# EAGLE design 612_jetracer_esp32s3_030002 (EAGLE 9.6.2)
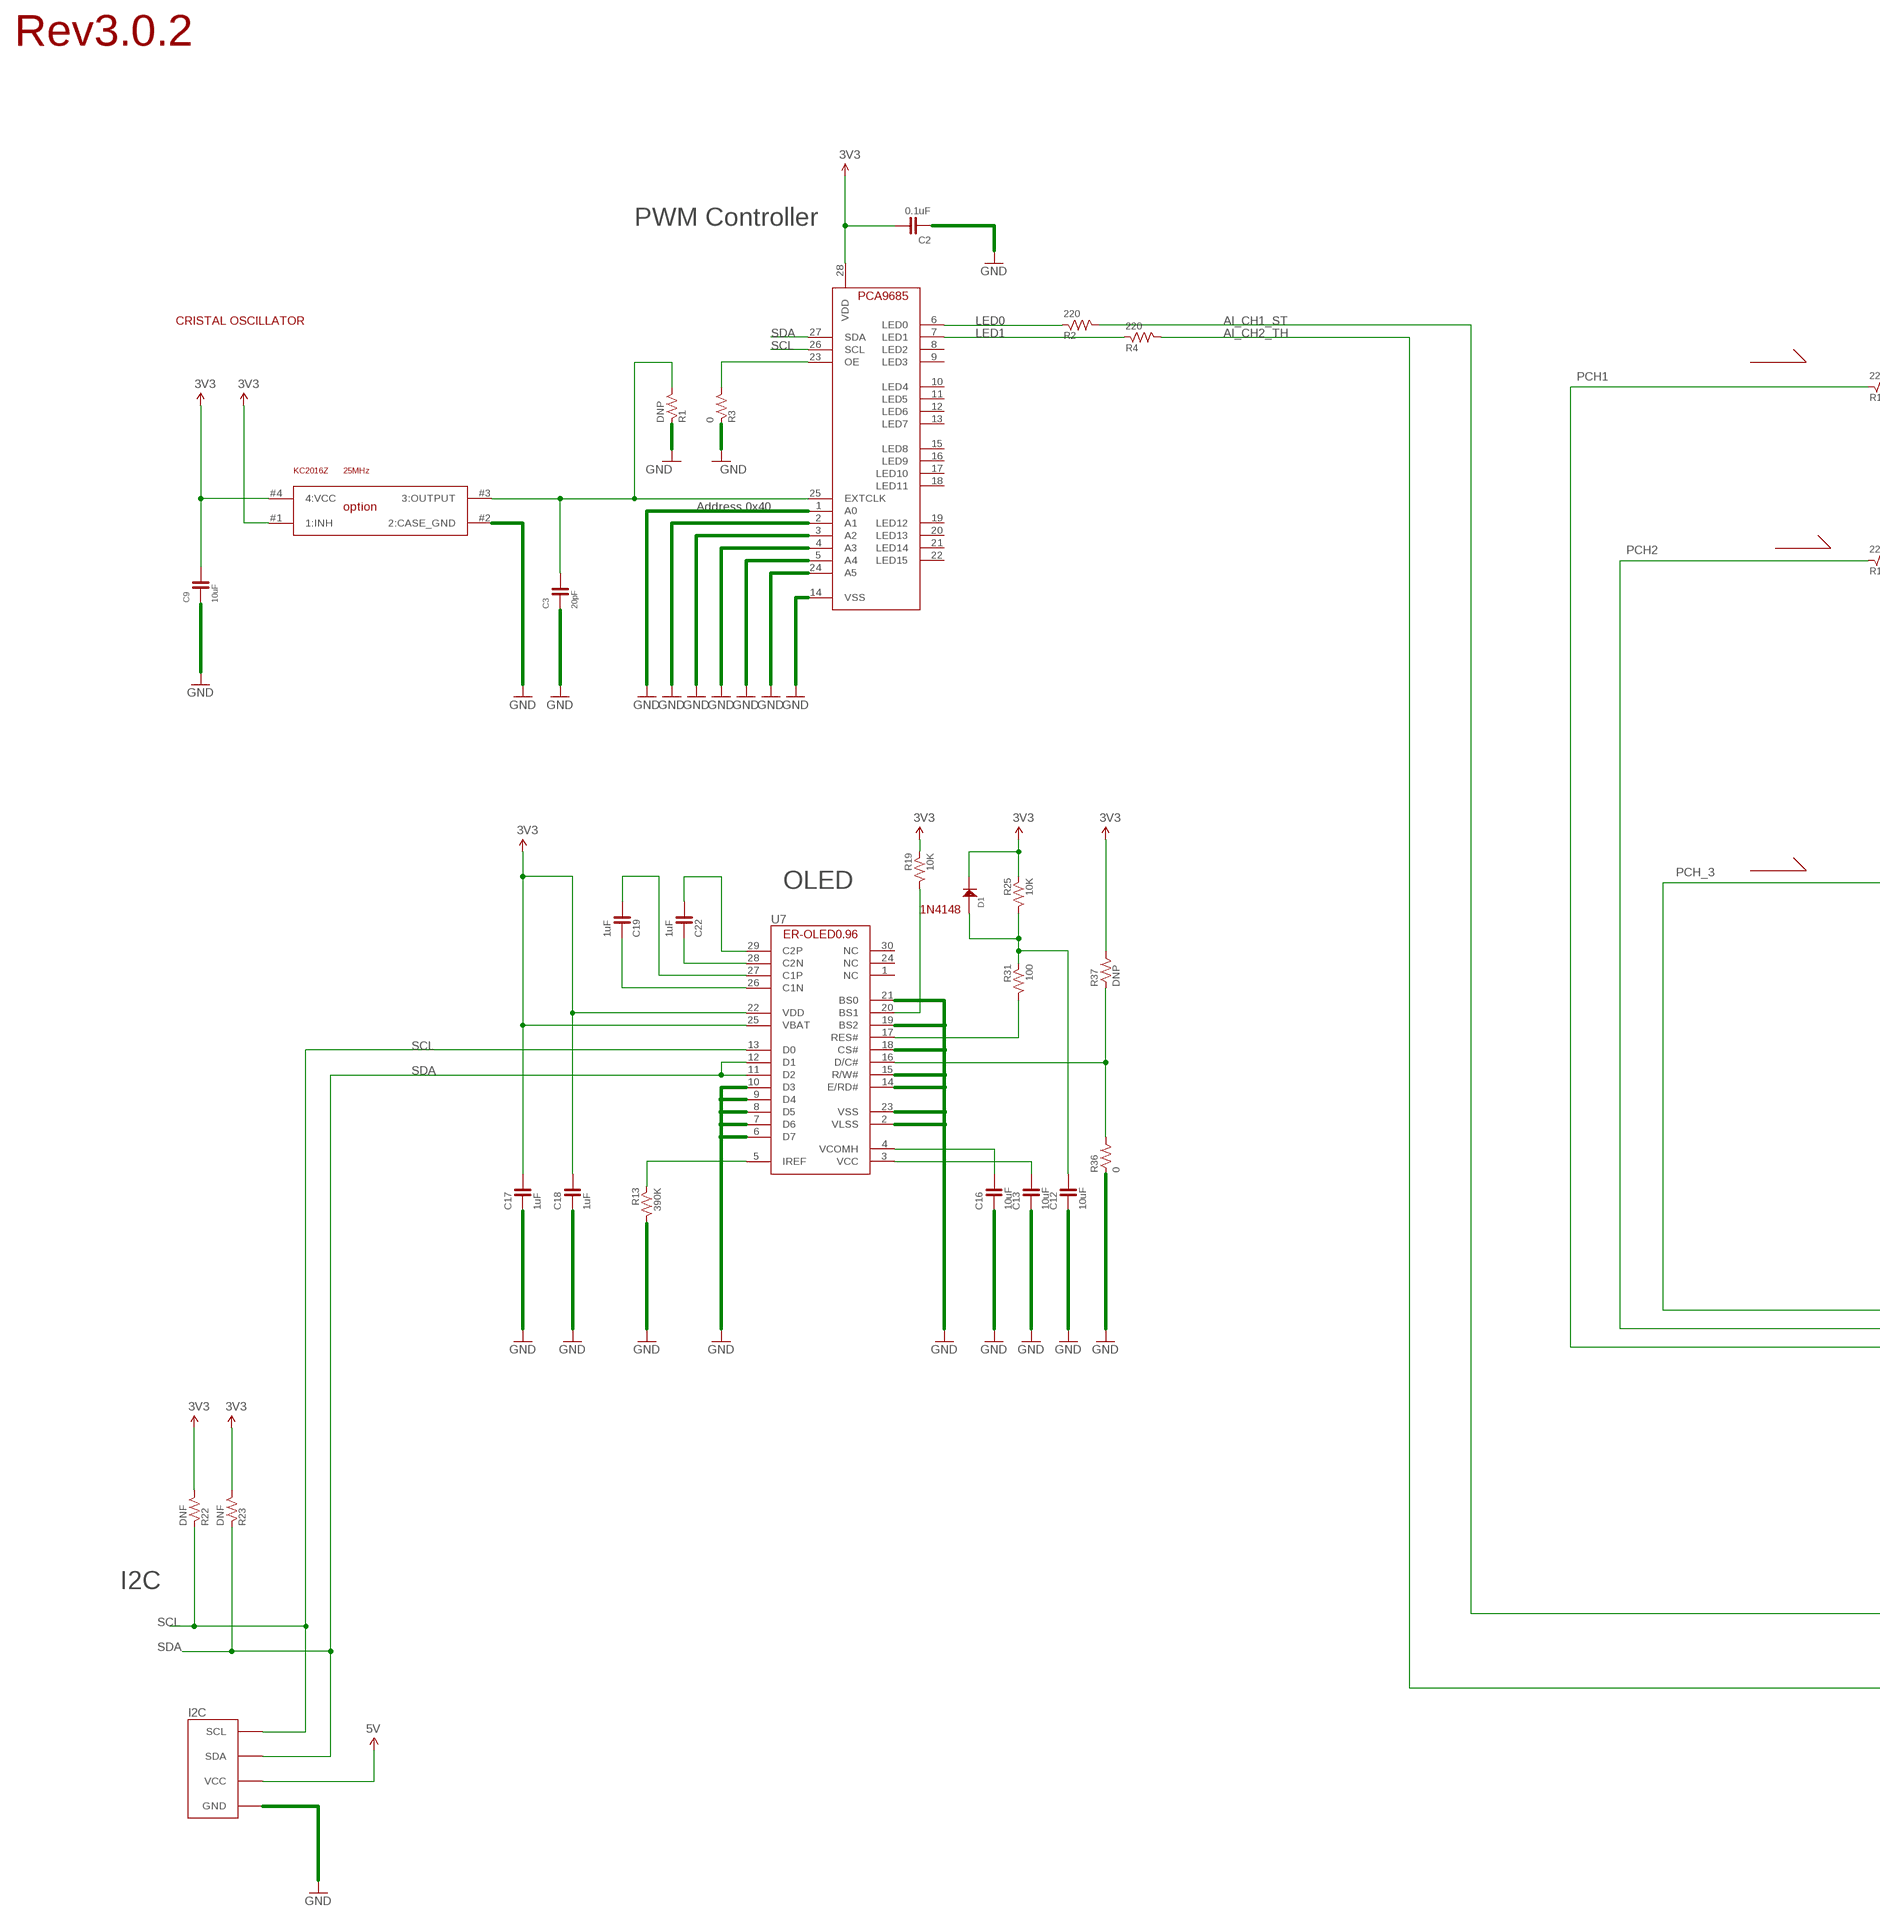
[diagram p0: schematic, sheet 1, part 1 of 3]
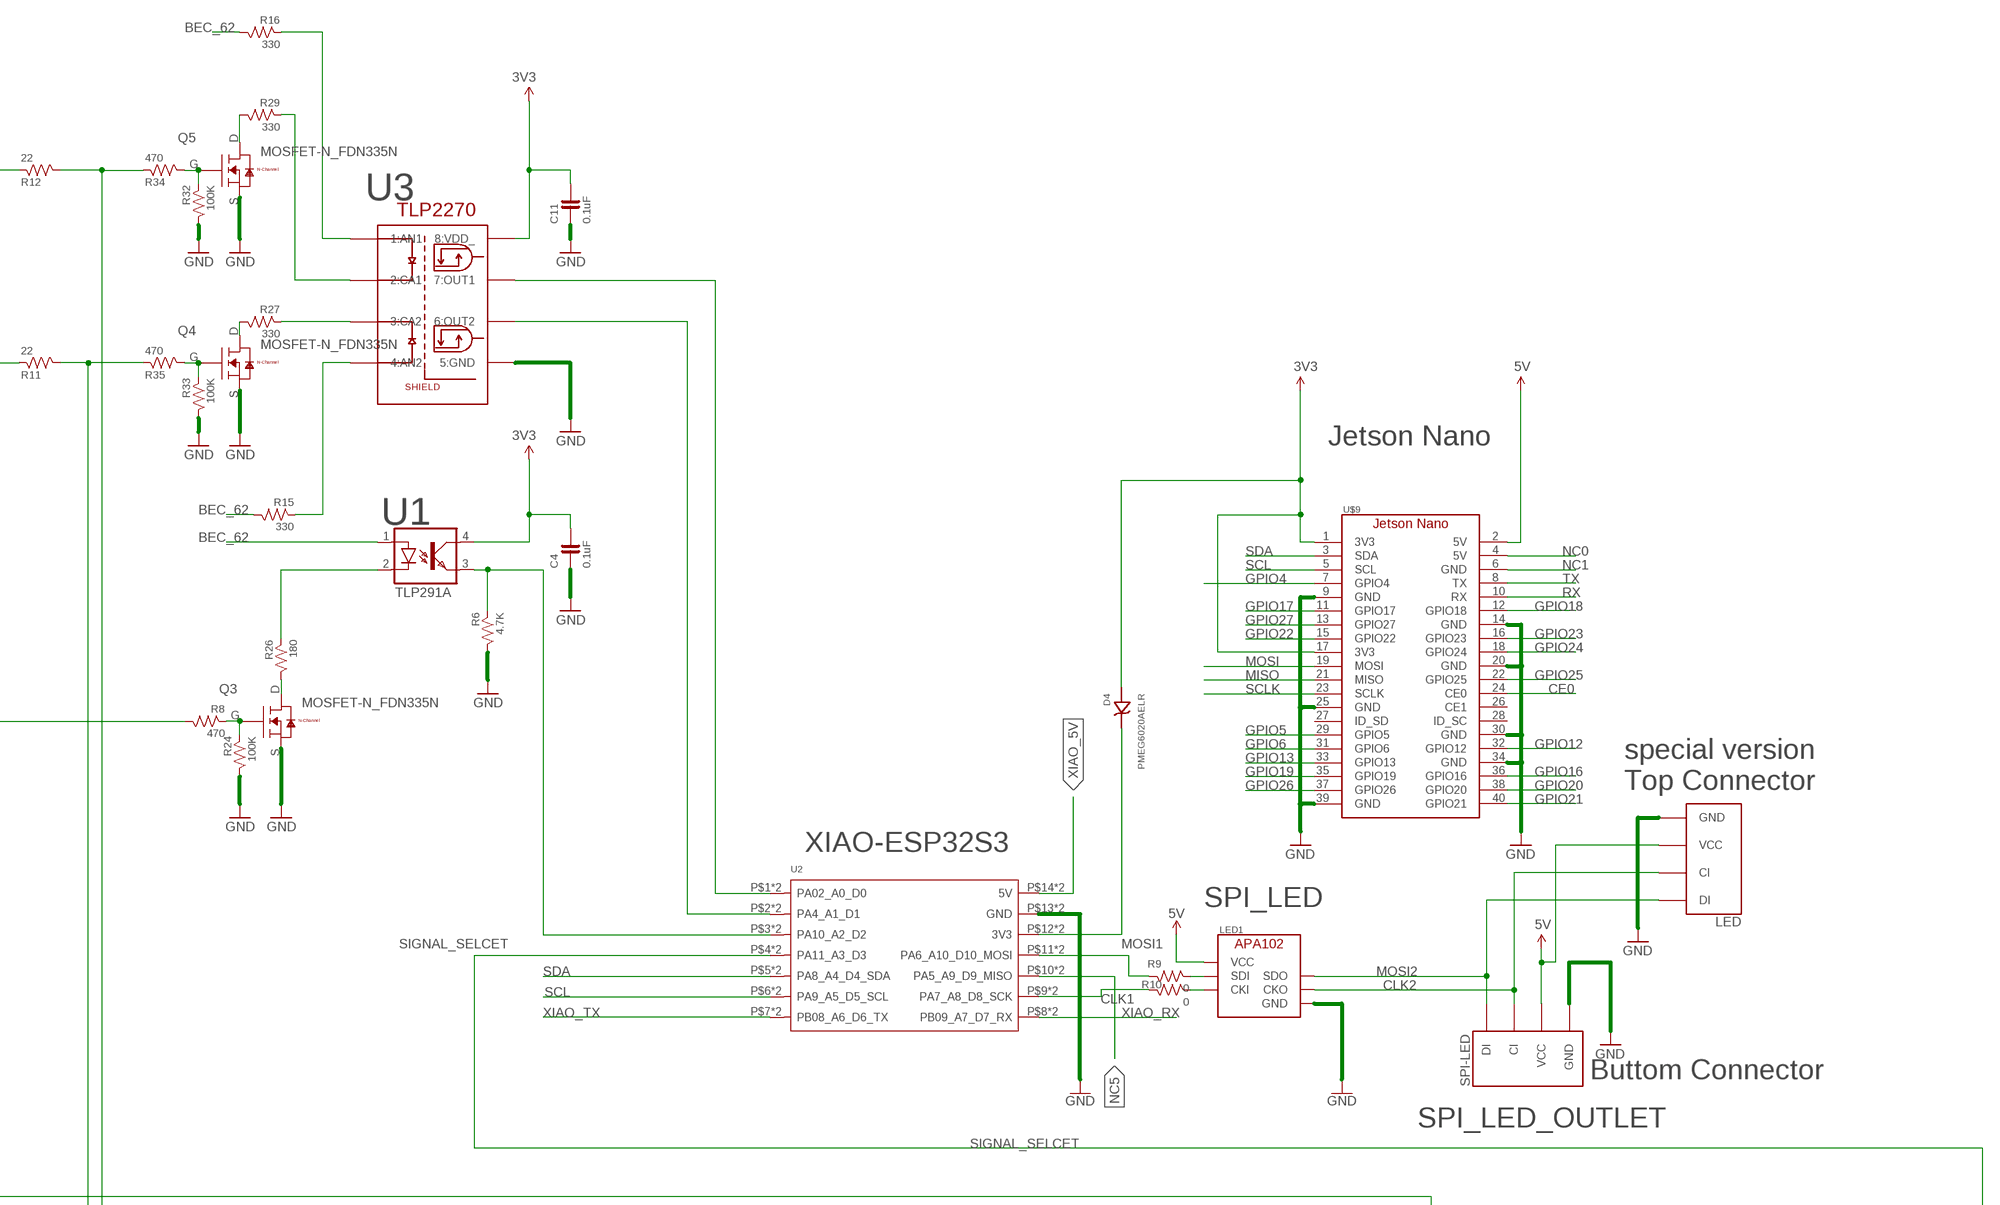
[diagram p1: schematic, sheet 1, part 2 of 3]
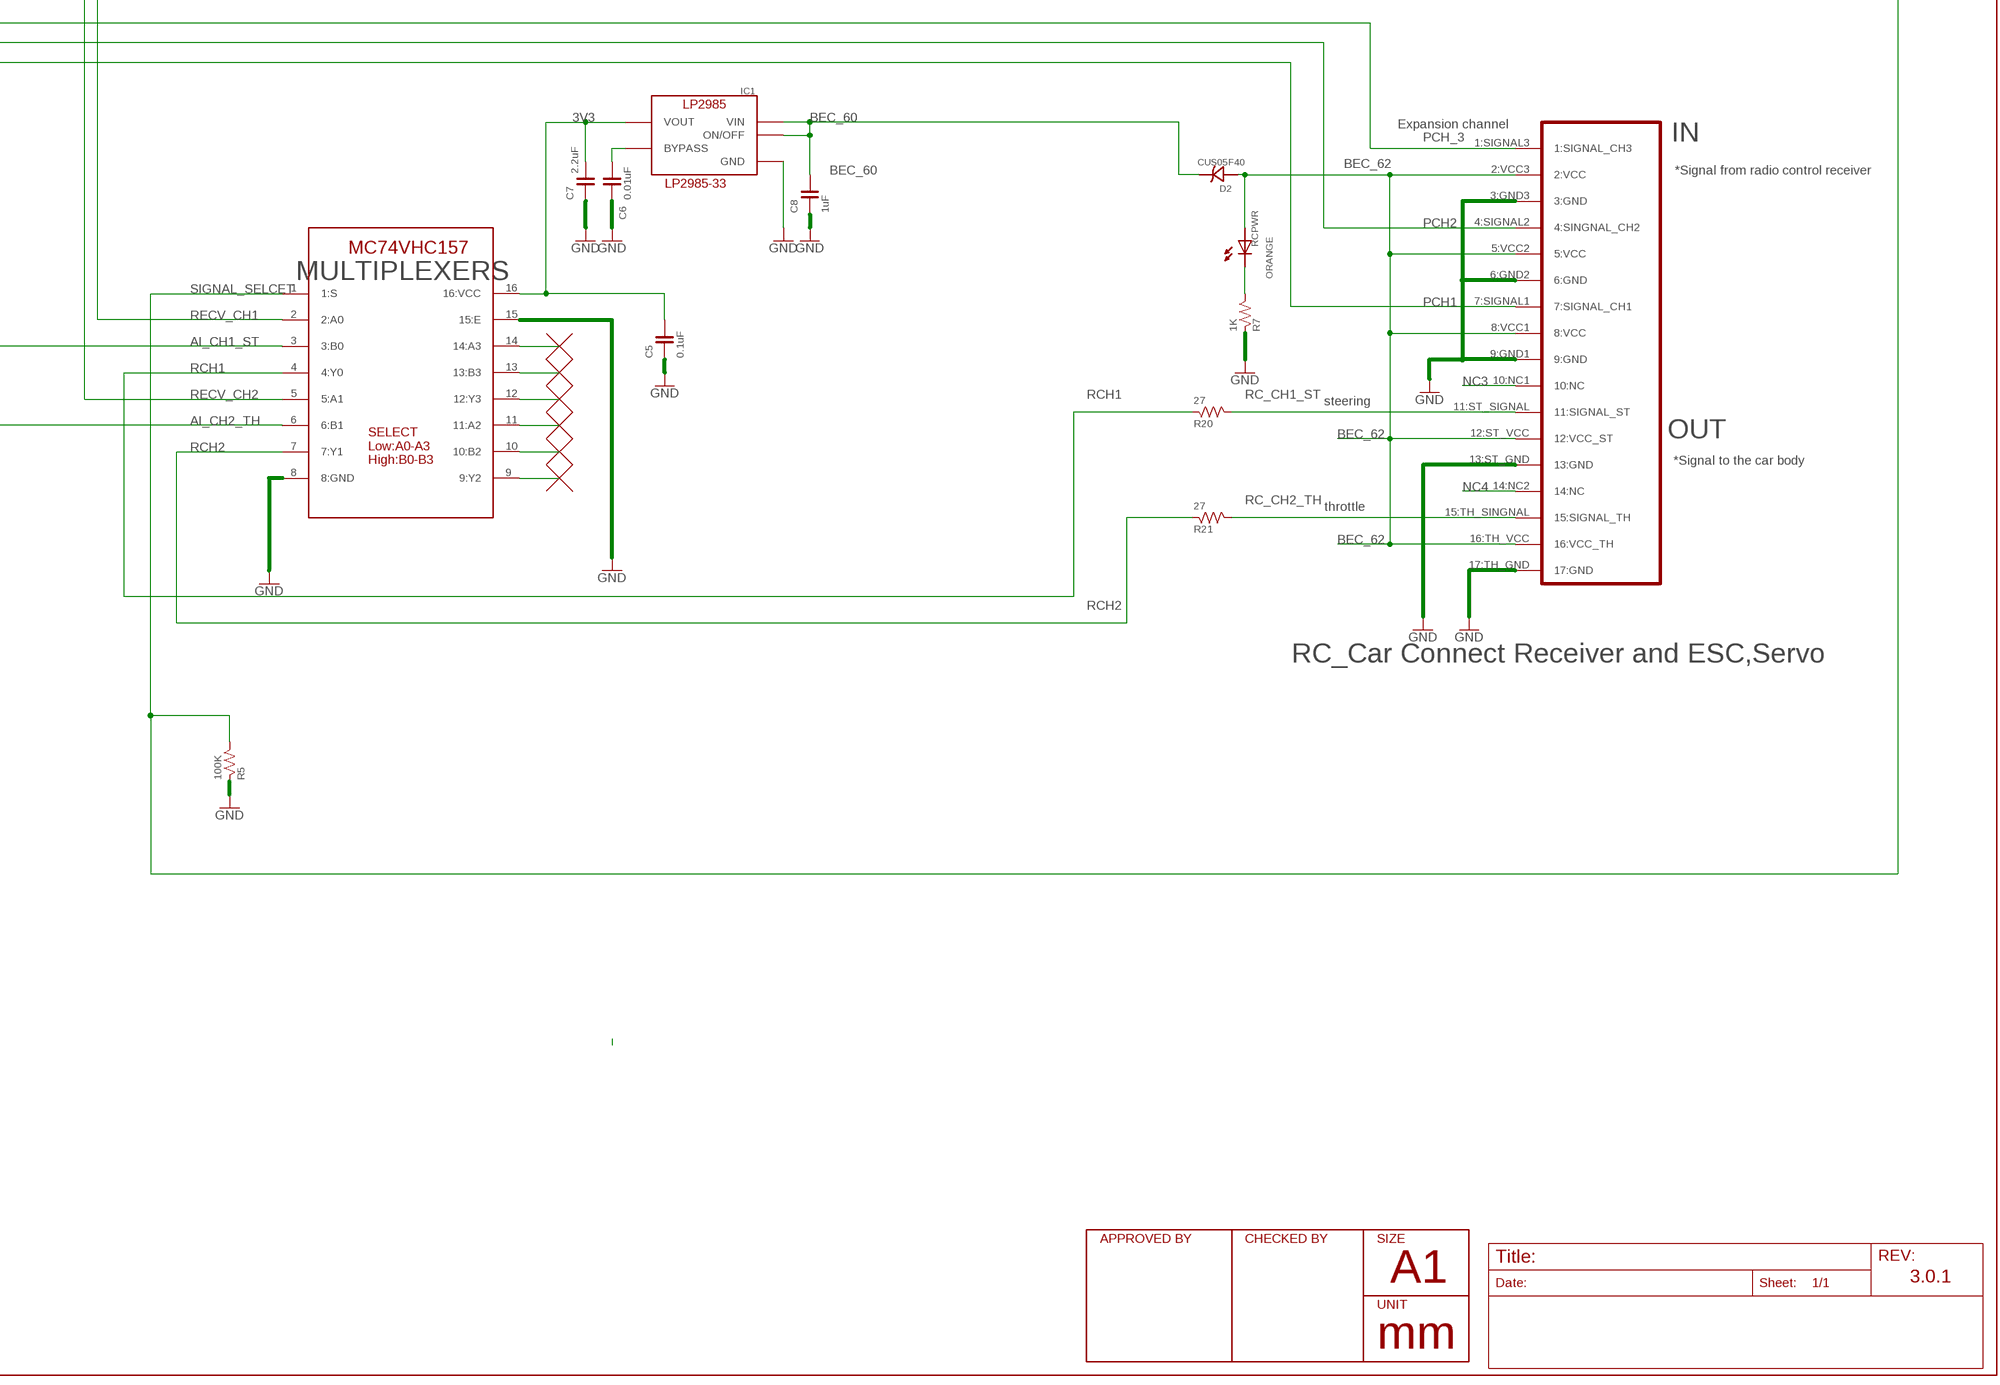
[diagram p2: schematic, sheet 1, part 3 of 3]

## Parts
C2  0.1uF  CAPACITOR-0603  [0603]
C3  20pF  CAPACITOR-0402  [0402]
C4  0.1uF  CAPACITOR-0603  [0603]
C5  0.1uF  CAPACITOR-0603  [0603]
C6  0.01uF  CAPACITOR-0603  [0603]
C7  2.2uF  CAPACITOR-0603  [0603]
C8  1uF  CAPACITOR-0603  [0603]
C9  10uF  CAPACITOR-0402  [0402]
C11  0.1uF  CAPACITOR-0603  [0603]
C12  10uF  CAPACITOR-0603  [0603]
C13  10uF  CAPACITOR-0603  [0603]
C16  10uF  CAPACITOR-0603  [0603]
C17  1uF  CAPACITOR-0603  [0603]
C18  1uF  CAPACITOR-0603  [0603]
C19  1uF  CAPACITOR-0603  [0603]
C22  1uF  CAPACITOR-0603  [0603]
D1  1N4148  [1N4148W]
D2  CUS05F40  [CUS05F40]
D4  PMEG6020AELR  [SOD123W]
I2C  FABO-I2C  [I2C-SM04B-PASS-1-FL]
IC1  LP2985-33DBV  [SOT-23-5]
IC4  PCA9685_BOTTOM  [PCA9685_BOTTOM]
LED  FABO-SPI-LED-B04B  [SPI-B04B-PASK-1]
LED1  APA102_IPIXEL  [APA102_2020]
Q3  MOSFET-N_FDN335N  [SUPERSOT-3]
Q4  MOSFET-N_FDN335N  [SUPERSOT-3]
Q5  MOSFET-N_FDN335N  [SUPERSOT-3]
R1  DNP  RESISTOR-0603  [0603]
R2  220  RESISTOR-0603  [0603]
R3  0  RESISTOR-0603  [0603]
R4  220  RESISTOR-0603  [0603]
R5  100K  RESISTOR-0603  [0603]
R6  4.7K  RESISTOR-0603  [0603]
R7  1K  RESISTOR-0603  [0603]
R8  470  RESISTOR-0603  [0603]
R9  0  RESISTOR-0603  [0603]
R10  0  RESISTOR-0603  [0603]
R11  22  RESISTOR-0603  [0603]
R12  22  RESISTOR-0603  [0603]
R13  390K  RESISTOR-0603  [0603]
R15  330  RESISTOR-0603  [0603]
R16  330  RESISTOR-0603  [0603]
R19  10K  RESISTOR-0603  [0603]
R20  27  RESISTOR-0603  [0603]
R21  27  RESISTOR-0603  [0603]
R22  DNF  RESISTOR-0603  [0603]
R23  DNF  RESISTOR-0603  [0603]
R24  100K  RESISTOR-0603  [0603]
R25  10K  RESISTOR-0603  [0603]
R26  180  RESISTOR-0603  [0603]
R27  330  RESISTOR-0603  [0603]
R29  330  RESISTOR-0603  [0603]
R31  100  RESISTOR-0603  [0603]
R32  100K  RESISTOR-0603  [0603]
R33  100K  RESISTOR-0603  [0603]
R34  470  RESISTOR-0603  [0603]
R35  470  RESISTOR-0603  [0603]
R36  0  RESISTOR-0805  [0805]
R37  DNP  RESISTOR-0805  [0805]
RCPWR  ORANGE  LED-0603  [0603]
SPI-LED  FABO-SPI-LED  [SPI-SM04B-PASS-1-FL]
U1  TLP291A  [11-3C1]
U2  MOUDLE-SEEEDUINO-XIAO-ESP32C3  [MOUDLE14P-DIP]
U3  TLP2270  [TLP2270]
U7  ER-OLED0.96-1ER-CON30HT-1  [ER-CON30HT-1]
U$1  RC_17PIN_OUTIN  [PNHEADER_2.54_SMT_17PIN_RC_TT01_02]
U$3  MC74VHC157  [MC74VHC157_TSSOP-16]
U$9  JETSON_NANOJETSON_NANO_OVERALL  [JETSON_NANO_DEMENTION]
U$11  KC2016Z  [KC2016Z]

## Nets
3V3: C5.2 C7.2 IC1.5(VOUT) U$3.16(16:VCC)
3V3_JETSON: C2.2 C4.2 C9.2 C11.2 C17.2 C18.2 D1.CATHODE D4.2(ANODE) IC4.28(VDD) R19.1 R22.2 R23.2 R25.1 R37.2 U1.4(COL) U3.8(8:VDD_) U7.22(VDD) U7.25(VBAT) U$9.1(3V3) U$9.17(3V3) U$11.#1(1:INH) U$11.#4(4:VCC) ; supply symbol labelled 3V3
5V_JETSON: I2C.5V(VCC) LED1.VCC LED.VCC SPI-LED.5V(VCC) U$9.2(5V) ; supply symbol labelled 5V
AI_CH1_ST: R2.2 U$3.3(3:B0)
AI_CH2_TH: R4.2 U$3.6(6:B1)
BEC_60: C8.2 D2.C(CATHODE) IC1.1(VIN) IC1.3(ON/OFF)
BEC_62: D2.A(ANODE) R15.2 R16.2 RCPWR.ANODE U1.1(A) U$1.2:VCC3(2:VCC) U$1.5:VCC2(5:VCC) U$1.8:VCC1(8:VCC) U$1.12:ST_VCC(12:VCC_ST) U$1.16:TH_VCC(16:VCC_TH)
CE0: U$9.24(CE0)
CK: LED1.CKI R10.1
CLK1: R10.2 U2.P$9(PA7_A8_D8_SCK) U2.P$23(PA7_A8_D8_SCK)
CLK2: LED1.CKO LED.CI SPI-LED.CI
GND: C2.1 C3.1 C4.1 C5.1 C6.1 C7.1 C8.1 C9.1 C11.1 C12.1 C13.1 C16.1 C17.1 C18.1 I2C.GND IC1.2(GND) IC4.1(A0) IC4.2(A1) IC4.3(A2) IC4.4(A3) IC4.5(A4) IC4.14(VSS) IC4.24(A5) LED1.GND LED.GND Q3.S Q4.S Q5.S R1.1 R3.1 R5.1 R6.2 R7.1 R13.2 R24.2 R32.2 R33.2 R36.1 SPI-LED.GND U2.P$13(GND) U2.P$27(GND) U3.5(5:GND) U7.2(VLSS) U7.6(D7) U7.7(D6) U7.8(D5) U7.9(D4) U7.10(D3) U7.14(E/RD#) U7.15(R/W#) U7.18(CS#) U7.19(BS2) U7.21(BS0) U7.23(VSS) U$1.3:GND3(3:GND) U$1.6:GND2(6:GND) U$1.9:GND1(9:GND) U$1.13:ST_GND(13:GND) U$1.17:TH_GND(17:GND) U$3.8(8:GND) U$3.15(15:E) U$9.9(GND) U$9.14(GND) U$9.20(GND) U$9.25(GND) U$9.30(GND) U$9.34(GND) U$9.39(GND) U$11.#2(2:CASE_GND)
GPIO4: U$9.7(GPIO4)
GPIO5: U$9.29(GPIO5)
GPIO6: U$9.31(GPIO6)
GPIO12: U$9.32(GPIO12)
GPIO13: U$9.33(GPIO13)
GPIO16: U$9.36(GPIO16)
GPIO17: U$9.11(GPIO17)
GPIO18: U$9.12(GPIO18)
GPIO19: U$9.35(GPIO19)
GPIO20: U$9.38(GPIO20)
GPIO21: U$9.40(GPIO21)
GPIO22: U$9.15(GPIO22)
GPIO23: U$9.16(GPIO23)
GPIO24: U$9.18(GPIO24)
GPIO25: U$9.22(GPIO25)
GPIO26: U$9.37(GPIO26)
GPIO27: U$9.13(GPIO27)
LED0: IC4.6(LED0) R2.1
LED1: IC4.7(LED1) R4.1
MISO: U$9.21(MISO)
MOSI: U$9.19(MOSI)
MOSI1: R9.2 U2.P$11(PA6_A10_D10_MOSI) U2.P$25(PA6_A10_D10_MOSI)
MOSI2: LED1.SDO LED.DI SPI-LED.DI
MS: LED1.SDI R9.1
N$2: U$3.9(9:Y2)
N$3: C22.2 U7.29(C2P)
N$4: U$3.10(10:B2)
N$5: U2.P$1(PA02_A0_D0) U2.P$15(PA02_A0_D0) U3.7(7:OUT1)
N$6: R26.1 U1.2(C)
N$7: IC4.23(OE) R3.2
N$8: U2.P$2(PA4_A1_D1) U2.P$16(PA4_A1_D1) U3.6(6:OUT2)
N$9: R15.1 U3.4(4:AN2)
N$12: R16.1 U3.1(1:AN1)
N$14: R13.1 U7.5(IREF)
N$16: C19.2 U7.27(C1P)
N$17: C13.2 U7.3(VCC)
N$18: R31.2 U7.17(RES#)
N$19: U$3.11(11:A2)
N$20: U$3.12(12:Y3)
N$21: C19.1 U7.26(C1N)
N$22: C22.1 U7.28(C2N)
N$23: Q3.G R8.1 R24.1
N$24: R7.2 RCPWR.CATHODE
N$25: C16.2 U7.4(VCOMH)
N$26: Q3.D R26.2
N$27: Q4.D R27.2
N$28: R27.1 U3.3(3:CA2)
N$29: Q5.D R29.2
N$30: R29.1 U3.2(2:CA1)
N$31: U$3.13(13:B3)
N$32: C12.2 D1.ANODE R25.2 R31.1
N$33: Q5.G R32.1 R34.2
N$34: D4.1(CATHODE) U2.P$12(3V3) U2.P$26(3V3)
N$35: U$3.14(14:A3)
N$37: R36.2 R37.1 U7.16(D/C#)
N$38: Q4.G R33.1 R35.2
N$40: C6.2 IC1.4(BYPASS)
N$41: C3.2 IC4.25(EXTCLK) R1.2 U$11.#3(3:OUTPUT)
N$50: R19.2 U7.20(BS1)
NC0: U$9.4(5V)
NC1: U$9.6(GND)
NC3: U$1.10:NC1(10:NC)
NC4: U$1.14:NC2(14:NC)
NC5: U2.P$10(PA5_A9_D9_MISO) U2.P$24(PA5_A9_D9_MISO)
PCH1: R12.1 U$1.7:SIGNAL1(7:SIGNAL_CH1)
PCH2: R11.1 U$1.4:SIGNAL2(4:SINGNAL_CH2)
PCH3_328: R6.1 U1.3(EMI) U2.P$3(PA10_A2_D2) U2.P$17(PA10_A2_D2)
PCH_3: R8.2 U$1.1:SIGNAL3(1:SIGNAL_CH3)
RC_CH1_ST: R20.2 U$1.11:ST_SIGNAL(11:SIGNAL_ST)
RC_CH2_TH: R21.2 U$1.15:TH_SINGNAL(15:SIGNAL_TH)
RCH1: R20.1 U$3.4(4:Y0)
RCH2: R21.1 U$3.7(7:Y1)
RECV_CH1: R12.2 R34.1 U$3.2(2:A0)
RECV_CH2: R11.2 R35.1 U$3.5(5:A1)
RX: U$9.10(RX)
SCL: I2C.SCL IC4.26(SCL) R22.1 U2.P$6(PA9_A5_D5_SCL) U2.P$20(PA9_A5_D5_SCL) U7.13(D0) U$9.5(SCL)
SCLK: U$9.23(SCLK)
SDA: I2C.SDA IC4.27(SDA) R23.1 U2.P$5(PA8_A4_D4_SDA) U2.P$19(PA8_A4_D4_SDA) U7.11(D2) U7.12(D1) U$9.3(SDA)
SIGNAL_SELCET: R5.2 U2.P$4(PA11_A3_D3) U2.P$18(PA11_A3_D3) U$3.1(1:S)
TX: U$9.8(TX)
XIAO_5V: U2.P$14(5V) U2.P$28(5V)
XIAO_RX: U2.P$8(PB09_A7_D7_RX) U2.P$22(PB09_A7_D7_RX)
XIAO_TX: U2.P$7(PB08_A6_D6_TX) U2.P$21(PB08_A6_D6_TX)
Unconnected: IC4.8(LED2) IC4.9(LED3) IC4.10(LED4) IC4.11(LED5) IC4.12(LED6) IC4.13(LED7) IC4.15(LED8) IC4.16(LED9) IC4.17(LED10) IC4.18(LED11) IC4.19(LED12) IC4.20(LED13) IC4.21(LED14) IC4.22(LED15) U7.1(NC) U7.24(NC) U7.30(NC) U$9.26(CE1) U$9.27(ID_SD) U$9.28(ID_SC)

## Notes on the sheet
- Rev3.0.2
- PWM Controller
- CRISTAL OSCILLATOR
- option | Address 0x40
- Jetson Nano
- OLED
- 1N4148
- special version
  Top Connector
- XIAO-ESP32S3
- SPI_LED
- Buttom Connector
- SPI_LED_OUTLET
- Expansion channel
- IN
- *Signal from radio control receiver
- LP2985-33
- MULTIPLEXERS
- I2C
- steering
- OUT
- *Signal to the car body
- SELECT
  Low:A0-A3
  High:B0-B3
- throttle
- RC_Car Connect Receiver and ESC,Servo
- 3.0.1

## Library data of the parts
C2-C9 C11-C13 C16-C19 C22 = FaBo-Capacitor:CAPACITOR: CAPACITOR
D1 = FaBo-Diode:1N4148
D2 = FaBo-Diode:CUS05F40
D4 = FaBo-Diode:PMEG6020AELR
I2C = FaBo-Connetor:FABO-I2C
IC1 = FaBo-Supply:LP2985: LP2985
IC4 = FaBo-Motor:PCA9685
LED SPI-LED = FaBo-Connetor:FABO-SPI-LED
LED1 = FaBo-LED:APA102
Q3-Q5 = FaBo-Mosfet:MOSFET-N
R1-R13 R15 R16 R19-R27 R29 R31-R36 = FaBo-Resistors:RESISTOR: RESISTOR
R37 = FaBo-Resistors:RESISTOR: RESISTOR; SPICEPREFIX: R
RCPWR = FaBo-LED:LED
U1 = FaBo_Photocoupler:TLP291A
U2 = FaBo-MPU:MOUDLE-SEEEDUINO-XIAO-ESP32C3
U3 = FaBo-Photocoupler:TLP2270
U7 = FaBo-Display:ER-OLED0.96-1: ER-CON30HT-1 Rev2 wide distance 0.23mm
U$1 = FaBo-PIN:RC_17PIN_OUTIN
U$3 = FaBo-Multiplexers:MC74VHC157
U$9 = FaBo-Boards:JETSON_NANO
U$11 = FaBo-Crystal:KC2016Z

## Board
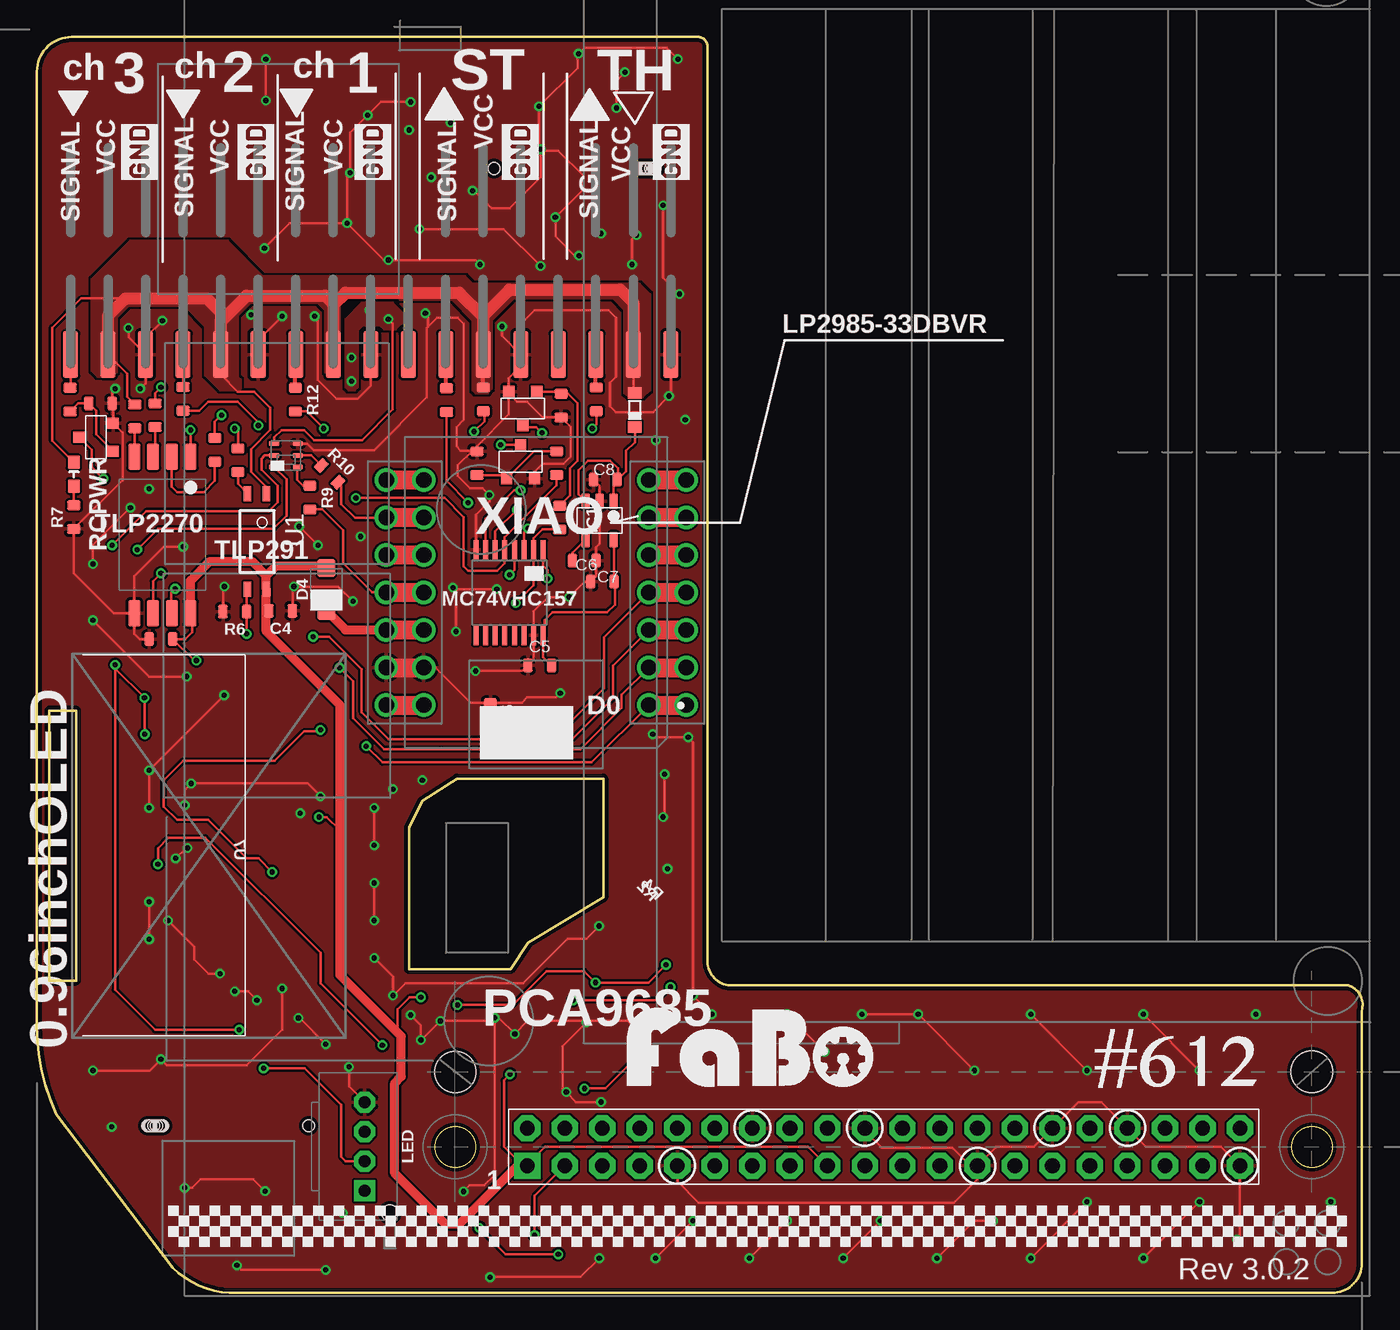
[diagram p3: board, top side]
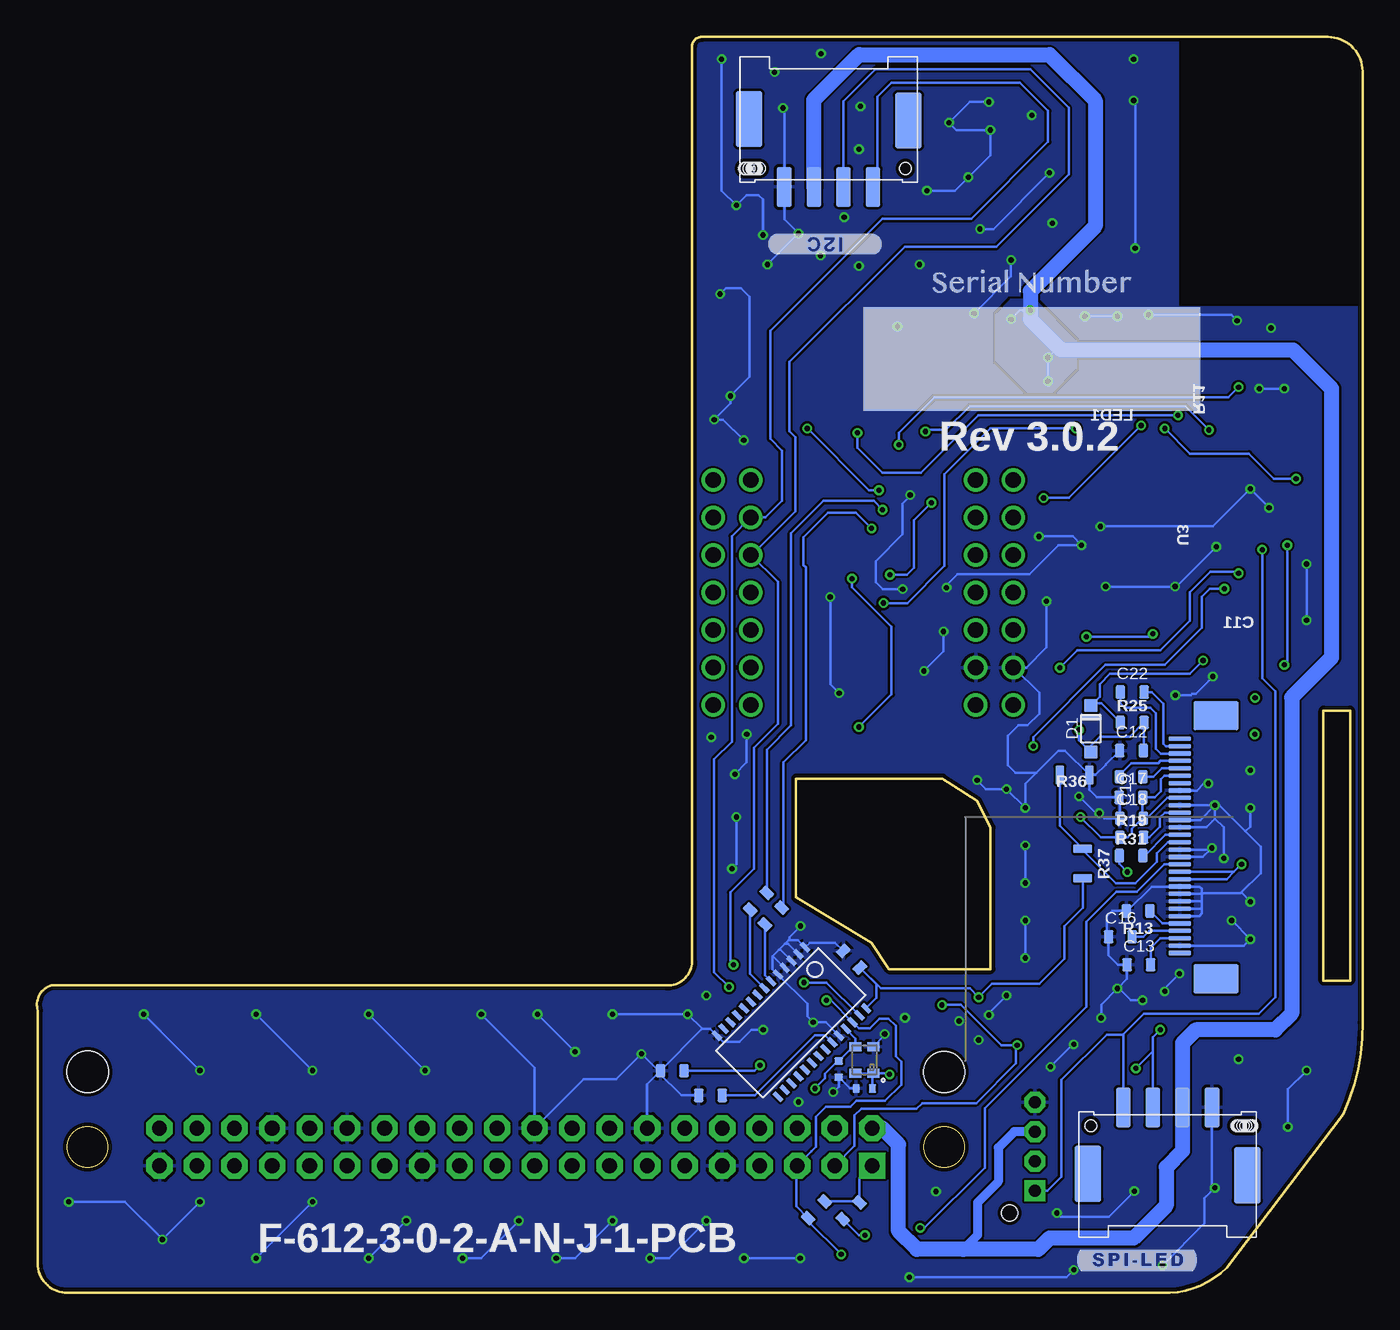
[diagram p4: board, bottom side, seen from below]

Size 89.76 x 85.01 mm. Coordinates in mm from the lower left corner, seen from the top.
Outline: 45.4,22.41 45.4,84.41 arc90 44.7,85.01 2.34,85.01 arc90 0,82.69 0,18.31 arc26 1.3,12.11 9.2,1.71 arc48 13.6,0.01 87.5,0.01 arc90 89.7,1.81 89.7,19.11 arc90 88.8,20.81 47.1,20.81 arc-90 45.4,22.41
Outline: 0.84,39.41 0.84,21.13 2.65,21.13 2.65,39.41 0.84,39.41
Outline: 25.2,21.91 25.2,31.51 26.1,33.31 28.43,34.81 38.36,34.81 38.36,26.77 33.27,23.71 32.06,21.91 28.2,21.91 25.2,21.91
Copper layers (1*16): Top 0.035mm / dielectric 1.6mm / Bottom 0.035mm
Design rules "PCBway": minimum track width 6mil, minimum drill 12mil, track to track 6mil, track to pad 6mil, pad to pad 6mil, via to via 6mil, smd to smd 6mil, copper to edge 10mil, drill to drill 10mil, minimum pad ring 10mil, minimum via ring 6mil, stop-mask expansion 2mil, vias tented up to drill 100mil, thermal gap 8mil
Holes 2.8 mm at 86.33,14.96 28.33,14.95
bRestrict: area -2.3,66.8 to 12.4,89.2; 7 lines

### Footprints (pad centres in the part's own frame; a part is rotated, then mirrored left to right if it is on the bottom)
0603 = smd 0.65 x 0.9: 1 -0.8,0; 2 0.8,0
0402 = smd 0.5 x 0.6: 1 -0.55,0; 2 0.55,0
1N4148W = smd 0.9 x 0.95: ANODE 0,0; CATHODE 3.15,0
CUS05F40 = smd 0.8 x 0.9: A -1.15,0; C 1.15,0
SOD123W = smd 1.2 x 1.2: 1 -1.45,0; 2 1.45,0
I2C-SM04B-PASS-1-FL = smd 1 x 2.7: 5V -1,0; GND -3,0; SCL 3,0; SDA 1,0 | smd 1.8 x 3.8: P$5 -5.4,4.6; P$6 5.4,4.5 | hole 0.8: 5.2,1.25; -4.7,1.25; -5.7,1.25; -5.6,1.25; -5.4,1.25; -5.2,1.25; -5.1,1.25; -5,1.25; -4.9,1.25
SOT-23-5 = smd 0.6 x 1.05: 1 -0.95,-1.3; 2 0,-1.3; 3 0.95,-1.3; 4 0.95,1.3; 5 -0.95,1.3
PCA9685_BOTTOM = smd 0.3 x 0.75 bottom: 1 4.3,-2.93; 2 3.65,-2.93; 3 3,-2.93; 4 2.35,-2.93; 5 1.7,-2.93; 6 1.05,-2.93; 7 0.4,-2.93; 8 -0.25,-2.93; 9 -0.9,-2.93; 10 -1.55,-2.93; 11 -2.2,-2.93; 12 -2.85,-2.93; 13 -3.5,-2.93; 14 -4.15,-2.93; 15 -4.15,2.92; 16 -3.5,2.92; 17 -2.85,2.92; 18 -2.2,2.92; 19 -1.55,2.92; 20 -0.9,2.92; 21 -0.25,2.92; 22 0.4,2.92; 23 1.05,2.92; 24 1.7,2.92; 25 2.35,2.92; 26 3,2.92; 27 3.65,2.92; 28 4.3,2.92
SPI-B04B-PASK-1 = drill 0.8 pad 1.422 octagon: CI 1,0.02; GND -3,0.02; VCC -1,0.02 | drill 0.8 pad 1.422 square: DI 3,0.02 | hole 1.1: 4.5,1.72
APA102_2020 = smd 0.7 x 0.35: CKI 0.8,0; CKO -0.8,0; GND 0.8,0.8; SDI 0.8,-0.8; SDO -0.8,-0.8; VCC -0.8,0.8
SUPERSOT-3 = smd 0.76 x 0.76: D 0,1.15; G -0.95,-1.15; S 0.95,-1.15
0805 = smd 0.6 x 1.3: 1 -1,0; 2 1,0
0603' = smd 0.9 x 0.8: ANODE -0.8,0; CATHODE 0.8,0
SPI-SM04B-PASS-1-FL = smd 1 x 2.7: 5V -1,-0.1; CI 1,-0.1; DI 3,-0.1; GND -3,-0.1 | smd 1.8 x 3.8: P$5 -5.4,4.5; P$6 5.4,4.4 | hole 0.8: 5.2,1.15; -4.7,1.15; -5.7,1.15; -4.8,1.15; -4.9,1.15; -5.1,1.15; -5.3,1.15; -5.5,1.15; -5.6,1.15
11-3C1 = smd 1 x 0.5: 1 -3.24,0.635; 2 -3.24,-0.635; 3 3.24,-0.635; 4 3.24,0.635
MOUDLE14P-DIP = drill 1.05: P$1 1.27,18.12; P$2 1.27,15.58; P$3 1.27,13.04; P$4 1.27,10.5; P$5 1.27,7.96; P$6 1.27,5.42; P$7 1.27,2.88; P$8 16.51,2.88; P$9 16.51,5.42; P$10 16.51,7.96; P$11 16.51,10.5; P$12 16.51,13.04; P$13 16.51,15.58; P$14 16.51,18.12; P$15 -1.27,18.12; P$16 -1.27,15.58; P$17 -1.27,13.04; P$18 -1.27,10.5; P$19 -1.27,7.96; P$20 -1.27,5.42; P$21 -1.27,2.88; P$22 19.05,2.88; P$23 19.05,5.42; P$24 19.05,7.96; P$25 19.05,10.5; P$26 19.05,13.04; P$27 19.05,15.58; P$28 19.05,18.12
TLP2270 = smd 0.8 x 1.8: 1 -1.905,-5.3; 2 -0.635,-5.3; 3 0.635,-5.3; 4 1.905,-5.3; 5 1.905,5.3; 6 0.635,5.3; 7 -0.635,5.3; 8 -1.905,5.3
ER-CON30HT-1 = smd 0.3 x 1.5 bottom: 1 7,-0.23; 2 6.5,-0.23; 3 6,-0.23; 4 5.5,-0.23; 5 5,-0.23; 6 4.5,-0.23; 7 4,-0.23; 8 3.5,-0.23; 9 3,-0.23; 10 2.5,-0.23; 11 2,-0.23; 12 1.5,-0.23; 13 1,-0.23; 14 0.5,-0.23; 15 0,-0.23; 16 -0.5,-0.23; 17 -1,-0.23; 18 -1.5,-0.23; 19 -2,-0.23; 20 -2.5,-0.23; 21 -3,-0.23; 22 -3.5,-0.23; 23 -4,-0.23; 24 -4.5,-0.23; 25 -5,-0.23; 26 -5.5,-0.23; 27 -6,-0.23; 28 -6.5,-0.23; 29 -7,-0.23; 30 -7.5,-0.23 | smd 2 x 3 bottom: 31 -9.07,-2.67; 32 8.74,-2.67
PNHEADER_2.54_SMT_17PIN_RC_TT01_02 = smd 1.02 x 3.17: 1:SIGNAL3 -20.32,0; 2:VCC3 -17.78,0; 3:GND3 -15.24,0; 4:SIGNAL2 -12.7,0; 5:VCC2 -10.16,0; 6:GND2 -7.62,0; 7:SIGNAL1 -5.08,0; 8:VCC1 -2.54,0; 9:GND1 0,0; 10:NC1 2.54,0; 11:ST_SIGNAL 5.08,0; 12:ST_VCC 7.62,0; 13:ST_GND 10.16,0; 14:NC2 12.7,0; 15:TH_SINGNAL 15.24,0; 16:TH_VCC 17.78,0; 17:TH_GND 20.32,0
MC74VHC157_TSSOP-16 = smd 1.26 x 0.36: 1 -2.9,2.275; 2 -2.9,1.625; 3 -2.9,0.975; 4 -2.9,0.325; 5 -2.9,-0.325; 6 -2.9,-0.975; 7 -2.9,-1.625; 8 -2.9,-2.275; 9 2.9,-2.275; 10 2.9,-1.625; 11 2.9,-0.975; 12 2.9,-0.325; 13 2.9,0.325; 14 2.9,0.975; 15 2.9,1.625; 16 2.9,2.275
JETSON_NANO_DEMENTION = drill 1 pad 1.778 square: 1 0,0 | drill 1 pad 1.778 octagon: 2 0,2.54; 3 2.54,0; 4 2.54,2.54; 5 5.08,0; 6 5.08,2.54; 7 7.62,0; 8 7.62,2.54; 9 10.16,0; 10 10.16,2.54; 11 12.7,0; 12 12.7,2.54; 13 15.24,0; 14 15.24,2.54; 15 17.78,0; 16 17.78,2.54; 17 20.32,0; 18 20.32,2.54; 19 22.86,0; 20 22.86,2.54; 21 25.4,0; 22 25.4,2.54; 23 27.94,0; 24 27.94,2.54; 25 30.48,0; 26 30.48,2.54; 27 33.02,0; 28 33.02,2.54; 29 35.56,0; 30 35.56,2.54; 31 38.1,0; 32 38.1,2.54; 33 40.64,0; 34 40.64,2.54; 35 43.18,0; 36 43.18,2.54; 37 45.72,0; 38 45.72,2.54; 39 48.26,0; 40 48.26,2.54
KC2016Z = smd 0.6 x 0.8: #1 -0.9,-0.6; #2 0.9,-0.6; #3 0.9,0.6; #4 -0.9,0.6

### Placement (x,y rotation side)
C2  34.6,22.58 315 bottom
C3  35.47,15.15 90 bottom
C4  16.5,46.16 180 top
C5  34.04,42.48 0 top
C6  37.06,49.57 180 top
C7  38.28,48.14 0 top
C8  38.48,55.05 0 top
C9  33.74,13.84 0 bottom
C11  8.4,44.26 0 top
C12  15.65,36.71 0 bottom
C13  15.15,22.21 0 bottom
C16  16.4,24.11 0 bottom
C17  15.68,33.54 0 bottom
C18  15.64,32.13 0 bottom
C19  15.68,34.94 180 bottom
C22  15.6,40.66 0 bottom
D1  18.4,36.61 90 bottom
D2  40.49,59.76 270 top
D4  19.6,47.61 90 top
I2C  36.15,74.86 0 bottom
IC1  38.1,52.28 180 top
IC4  38.72,18.28 135 top
LED  22.17,9.92 270 top
LED1  16.87,56.69 0 top
Q3  4,57.91 90 top
Q4  32.75,56.26 0 top
Q5  32.9,59.86 180 top
R1  46.74,15.04 0 bottom
R2  39.9,25.51 45 bottom
R3  44.15,13.37 0 bottom
R4  40.9,26.51 45 bottom
R5  30.7,39.11 270 top
R6  13.4,46.11 180 top
R7  2.5,52.51 90 top
R8  2.25,60.46 90 top
R9  18.48,53.83 270 top
R10  19.82,55.44 315 top
R11  9.9,60.51 270 top
R12  17.5,60.46 270 top
R13  15.2,25.86 180 bottom
R15  6.62,59.33 90 top
R16  30.23,60.48 90 top
R19  15.63,30.84 0 bottom
R20  27.73,60.43 90 top
R21  37.88,60.48 90 top
R22  36.98,5.63 45 bottom
R23  34.63,5.56 45 bottom
R24  4.3,60.21 0 top
R25  15.6,38.61 0 bottom
R26  13.61,56.36 90 top
R27  8,59.41 90 top
R29  12.05,57.06 90 top
R31  15.68,29.59 0 bottom
R32  35.5,60.06 270 top
R33  29.8,56.16 90 top
R34  35.39,52.48 90 top
R35  35.2,56.16 90 top
R36  19.5,35.06 180 bottom
R37  18.95,29.06 270 bottom
RCPWR  ORANGE  [0603']  2.5,55.41 270 top
SPI-LED  13.2,12.46 180 bottom
U1  14.9,50.86 270 top
U2  42.7,57.91 180 top
U3  8.5,51.31 180 top
U7  12.6,30.01 270 top
U$1  22.6,63.51 0 top
U$2  [LOGO_FABO_L]  47.6,13.96 0 top
U$3  32,47.41 270 top
U$5  [LOGO_SILK_GND]  16.1,75.31 90 top
U$6  [LOGO_SILK_GND]  24,75.31 90 top
U$7  [LOGO_SILK_GND]  34,75.31 90 top
U$8  [LOGO_SILK_GND]  44.2,75.31 90 top
U$9  33.2,8.61 0 top
U$11  33.73,15.77 90 bottom
U$12  [LOGO_SILK_GND]  8.2,75.31 90 top

### Tracks (layer width: path | path; a pad name or v marks a point on that pad's centre or on a via)
3V3
  Top 0.152: 39.13,50.9 IC1.5 39.08,50.95 C7.2 39.13,48.09 39.13,46.58 38.61,46.06 34.9,46.06 34.36,45.52 34.36,44.43 U$3.16 34.28,43.04 C5.2
3V3_JETSON  (via drill 0.35)
  Top 0.152: U$9.17 52.22,9.91 34.4,9.91 33.2,8.71 U$9.1 32.9,8.61 31.63,9.89 31.63,14.39 v32.03,14.79 | U3.8 10.51,45.91 10.51,44.71 10.05,44.26 C11.2 10.65,42.81 v10.8,42.81 | v19.1,32.21 19.62,32.21 20.52,31.31 | v26,20.01 25.24,20.01 24.42,19.19 24.42,17.61 | C4.2 15.54,46.32 15.54,47.23
  Top 0.61: 15.54,48.54 U1.4 15.54,47.23 15.54,44.77 20.52,39.79 20.52,31.31 20.52,21.51 24.42,17.61 24.67,17.36 24.67,14.65 24.22,14.2 24.22,8.1 27.66,4.66 28.6,4.66 32.55,8.61 U$9.1 | 15.54,48.54 16.2,49.21 19.45,49.21 D4.2 | U3.8 10.4,48.21 11.7,49.51 14.57,49.51 15.54,48.54
  Bottom 0.152: U$9.1 34.06,7.75 R23.2 34.13,6.2 R22.2 | 34.08,14.62 U$11.#4 34.31,14.85 33.19,14.85 | R25.1 17.7,39.91 18.25,39.91 D1.CATHODE 17.8,40.36 17.8,41.21 17.1,41.91 11.7,41.91 v10.8,42.81 | R19.1 | R37.2 18.95,26.06 20.2,24.81 20.2,22.61 21.9,20.91 25.1,20.91 v26,20.01 26.6,20.61 32.62,20.61 C2.2 32.9,20.89 32.9,19.96 IC4.28 | U7.25 13.41,35.01 13.66,34.76 13.66,33.94 14.07,33.54 C17.2 14.9,33.52 14.9,32.13 | U7.22 13.21,33.51 14.59,32.13 C18.2 14.9,32.13 | R19.1 15.88,30.84 15.62,31.1 15.62,31.4 14.9,32.13 | v19.1,32.21 17.73,30.84 R19.1 | C9.2 33.19,14.85 | 33.19,14.85 33.15,14.85 U$11.#1 32.11,14.87 v32.03,14.79
5V_JETSON  (via drill 0.35)
  Top 0.152: v23.8,65.91 24.1,65.61 24.1,59.81 22.01,57.72 18.77,57.72 18.1,58.39 16.56,58.39 16.07,57.9 LED1.VCC
  Bottom 0.152: v22.5,66.51 23.2,66.51 v23.8,65.91 | v21.3,61.71 v21.3,63.31 20.8,63.81 20.8,64.21
  Bottom 0.61: LED.VCC 23.59,10.92 24.66,9.84 24.66,7.53 26.08,6.11 26.08,3.91 27.04,2.95
  Bottom 1.016: 12.2,12.71 SPI-LED.5V | SPI-LED.5V 12.2,16.91 11.3,17.81 5.9,17.81 4.8,18.91 4.8,40.31 2.1,43.01 2.1,61.21 4.7,63.81 20.4,63.81 20.8,64.21 22.5,65.91 v22.5,66.51 22.5,67.81 18.1,72.21 18.1,80.71 21.2,83.81 34.1,83.81 37.15,80.76 I2C.5V | SPI-LED.5V 12.2,9.61 13.3,8.51 13.3,5.91 15.5,3.71 21.2,3.71 21.96,2.95 27.04,2.95 30.19,2.95 31.42,4.18 31.42,10.05 32.52,11.15 U$9.2
  pour Bottom (no thermals): 19.4,62.61 19.4,64.41 22.2,67.21 23.8,67.21 24.8,66.21 24.8,63.11 22.7,61.01 21,61.01
  pour Top (no thermals): 20.9,65.91 20.9,61.31 21.1,61.11 21.5,61.11 21.7,61.31 21.7,65.11 22.1,65.51 23.2,65.51 23.5,65.21 24.3,65.21 25,65.91 25,66.11 24.1,67.01 22,67.01
AI_CH1_ST  (via drill 0.35)
  Top 0.152: U$3.3 32.98,51.48 v33.25,51.75
  Bottom 0.152: R2.2 39.2,26.21 39.2,35.91 37.7,37.41 37.7,49.11 37.86,49.27 37.86,51.14 36.19,52.81 34.31,52.81 v33.25,51.75
AI_CH2_TH  (via drill 0.35)
  Top 0.152: U$3.6 31.03,51.54 v32.5,53.01
  Bottom 0.152: R4.2 40.33,36.78 38.7,38.41 38.7,51.41 36.5,53.61 33.1,53.61 v32.5,53.01
BEC_60
  Top 0.152: D2.C 40.49,57.59 39.9,57.01 39.9,55.62 39.38,55.1 | IC1.3 36.68,54.06 36.68,55.69 37.31,56.32 38.81,56.32 39.33,55.8 39.33,55.1 | 39.33,55.1 C8.2 | 39.38,55.1 39.33,55.1 | IC1.1 39.05,54.77 39.38,55.1
BEC_62
  Top 0.152: R16.2 30.2,61.3 | U$1.16:TH_VCC 40.38,61.01 D2.A | R15.2 6.1,60.65 6.1,62.23 U$1.2:VCC3 | U1.1 15.54,54.55 14.49,55.59 14.49,57.1 15.8,58.41 15.8,59.91 14.7,61.01 13.6,61.01 12.44,62.17 U$1.5:VCC2 | RCPWR.ANODE 1.03,57.68 1.03,65.34 3,67.31 6.3,67.31
  Top 0.254: R16.2 U$1.12:ST_VCC
  Top 0.813: U$1.2:VCC3 4.82,66.13 6,67.31 6.3,67.31 11.5,67.31 12.44,66.37 U$1.5:VCC2 12.44,65.75 14.2,67.51 19.5,67.51 20.1,66.91 | 20.1,66.91 20.1,63.55 U$1.8:VCC1 | 20.1,66.91 20.9,67.71 28.6,67.71 30.2,66.11 | U$1.12:ST_VCC 30.2,63.53 30.2,66.11 | 30.2,66.11 32,67.91 39.5,67.91 40.38,67.03 U$1.16:TH_VCC
  pour Top (no thermals): 3.7,62.41 3.7,68.61 6.3,71.21 12.9,71.21 15.3,68.81 29,68.81 29.5,68.31 40.8,68.31 41.5,67.61 41.5,61.11 41,60.61 40.1,60.61 39.8,60.91 39.8,66.51 39,67.31 32.3,67.31 30.8,65.81 30.8,61.21 30.5,60.91 29.7,60.91 29.5,61.11 29.5,65.81 28.1,67.21 24.6,67.21 24.4,67.41 21,67.41 20.5,66.91 20.5,62.11 20.4,62.01 19.8,62.01 19.5,62.31 19.5,66.51 19,67.01 14.47,67.01 13.6,66.14 13.6,62.01 13.8,61.81 13.8,61.21 13.7,61.11 12.4,61.11 11.4,62.11 11.4,65.41 10,66.81 6.2,66.81 5.4,66.01 5.4,62.31 5.1,62.01 4.1,62.01
CK
  Top 0.152: LED1.CKI 18.57,56.69 R10.1
CLK1
  Top 0.152: R10.2 20.61,54.65 20.61,53.38 21.53,52.46 23.62,52.46 U2.P$23
  Top 1.27: U2.P$23 U2.P$9
CLK2  (via drill 0.35)
  Top 0.152: v5.1,50.61 7.4,52.91 15.7,52.91 16.3,53.51 16.3,54.63 15.2,55.73 15.2,56.46 15.43,56.69 LED1.CKO | v13.7,17.81 8,17.81 5.3,20.51 v5.3,42.51 5.3,42.26 v7.28,40.27 7.31,40.25 v7.31,37.81 | v15.35,15.2 18.13,15.2 20.6,12.73 20.6,9.21 20.9,8.91 LED.CI
  Bottom 0.152: v5.1,50.61 5.1,42.71 v5.3,42.51 | v13.7,17.81 14.2,17.31 SPI-LED.CI 14.2,16.34 v15.35,15.2
GND  (via drill 0.35)
  Top 0.152: 29.8,57.01 R33.2 29.45,56.96 28.5,56.01 28.5,55.31 29.34,54.47 30.18,54.47 v30.63,54.01 30.63,53.58 29.73,52.67 U$3.8 | 29.8,57.01 29.8,57.31 31.95,59.46 31.95,60.86 | 31.95,60.86 Q5.S 31.95,61.91 32.65,62.61 32.65,63.4 U$1.13:ST_GND | 31.95,60.86 32.5,60.31 33.2,60.31 34.25,59.26 R32.2 36.12,58.64 36.12,56.59 35.67,56.13 34.24,56.13 33.7,55.59 Q4.S | U2.P$13 26.98,42.33 29.35,39.96 30.65,39.96 R5.1 30.75,39.96 32.85,39.96 33.19,40.3 35.13,40.3 v35.43,40.6 | U$1.3:GND3 7.36,64.67 v8.5,65.81 | v14.5,66.21 14.98,65.73 U$1.6:GND2 14.98,64.49 v16.6,66.11 | v5.3,61.21 5.1,61.01 R24.2 5.15,60.16 Q3.S 5.8,58.21 5.8,55.01 R7.1 2.5,48.71 5.2,46.01 U3.5 | v7,61.21 7.36,61.57 U$1.3:GND3 | U$1.3:GND3 6.2,64.67 v6.2,65.31 | v18.8,66.11 19,65.91 19,61.81 20.3,60.51 21.7,60.51 22.6,61.41 U$1.9:GND1 | v12.7,47.81 12.6,47.71 R6.2 | U3.5 6.59,48.5 8.6,50.51 v9.9,50.51 | U$9.9 43.36,7.55 44.8,6.11 62.1,6.11 63.68,7.69 U$9.25 | U$9.25 63.2,8.61 62,9.81 57.2,9.81 56.06,10.95 U$9.20 | U$9.25 64.98,9.91 67.52,9.91 U$9.30 70.52,12.91 72.08,12.91 U$9.34 75.08,9.91 80.16,9.91 U$9.39 81.46,3.82 v81.26,3.62 | v21.4,46.81 20.4,47.81 v17.4,47.81 17.3,47.71 C4.1 | LED1.GND 18.3,57.49 18.75,57.04 22.83,57.04 26.4,60.61 26.4,65.31 26.5,65.41 | 26.5,65.41 27.1,66.01 28.5,66.01 28.9,65.61 28.9,59.11 28.4,58.61 28.4,57.31 28.7,57.01 29.8,57.01 | U$1.17:TH_GND 42.92,60.83 v42.8,60.71 41.7,59.61 39.2,59.61 38.8,60.01 38.8,61.61 39.2,62.01 39.2,66.01 38.7,66.51 33.7,66.51 32.76,65.57 U$1.13:ST_GND | U3.5 6.59,44.61 6.95,44.26 C11.1 | 49,16.01 v48.83,16.18 | v16.6,20.61 16.6,17.81 14.2,15.41 8.8,15.41 v8.4,15.81 7.64,15.05 v3.79,15.05
  Top 0.152: v10,33.01 10,34.03 v10.45,34.48 18.32,34.48 v19.2,33.61 | 37.3,18.4 v37.2,18.31 35.6,16.71 35.6,13.84 v35.84,13.6 36.52,12.92 v38.2,12.92 | 37.3,18.4 37.3,18.41 39.99,18.41 v40.59,17.81 | v10.2,30.11 10.1,30.11 v9.4,29.41 | v13.4,20.41 14.3,20.41 v14.9,19.81 | v10,7.11 10.5,7.11 11.1,7.71 14.64,7.71 v15.46,6.89 | v78.72,6.16 v74.91,2.35 | v71.1,6.16 v67.29,2.35 | v64.75,4.89 63.48,4.89 v60.94,2.35 | v57.13,4.89 v54.59,2.35 | v50.78,4.89 v48.24,2.35 | v44.43,4.89 v41.89,2.35 | v38.08,2.35 36.81,1.08 30.71,1.08 v30.68,1.05 | v7.6,32.83 v7.6,35.37 v12.68,40.45 | v10.14,41.72 7.6,41.72 v3.79,45.53 | v3.79,49.34 3.79,50.61 v6.33,53.15 | v17.76,51.88 v19.03,50.61 | v22.84,32.83 v22.84,30.29 | v22.84,27.75 v22.84,25.21 | v22.84,22.67 24.11,21.4 v24.11,20.13 24.95,20.97 32.93,20.97 35.94,23.98 37.21,23.98 v38.06,24.83 | v63.48,15.05 v59.67,18.86 v55.86,18.86 | v67.29,18.86 v71.1,15.05 | v74.91,18.86 v78.72,15.05 | v7.6,23.94 v7.6,26.48 | v53.32,16.32 v50.78,18.86 | v45.7,18.86 v44.43,20.13 44.43,37.28 v44.1,37.61 41.9,37.61 v41.7,37.81 | U$1.13:ST_GND 31.5,64.77 v31.5,65.41 | 26.5,65.41 26.5,66.11 v26.3,66.31 | v21,72.41 23.5,69.91 v23.8,69.91 29.7,69.91 v30,69.61 | v21,72.41 21,75.61 v21.2,75.81 21.2,78.51 v22.4,79.71 23.3,80.61 v25.3,80.61 | v25.9,72.01 31.6,72.01 v34.1,69.51 | v36.7,70.21 36.4,70.21 35.1,71.51 v35.1,72.81 37,74.71 37,75.61 35.3,77.31 34.1,77.31 | v43.4,83.51 42.62,84.29 37.08,84.29 v36.67,83.88 36.59,83.88 36.59,82.9 v34,80.31 34,77.51 v34.1,77.41 34.1,77.31 | v42.4,73.61 42.4,68.71 v43.5,67.61 | v21,72.41 17.1,72.41 v15.4,70.71 | v15.5,80.71 v15.5,83.51 | v42.5,35.11 42.5,32.31 v42.4,32.21
  Top 0.152: LED.GND 21.13,13.98 v21.13,15.3 | v19.56,16.82 17.77,18.61 v17.7,18.61 | v19.56,1.56 13.84,1.56 v13.54,1.86 | v28.37,44.76 28.37,47.53 v28.17,47.74 28.27,47.63 v31.14,47.63 | v12.4,21.61 11.62,21.61 10.64,22.59 10.64,23.44 v8.87,25.21 | v29.5,74.61 29.6,74.61 30.8,73.41 32,73.41 34.1,75.51 34.1,77.31 | v40.6,71.61 40.3,71.31 v40.3,69.61 | 37.3,18.4 33.23,18.4 v32.36,17.53 31.27,18.62 31.07,18.62 | 31.07,18.62 v30.99,18.62 30.78,18.41 v27.32,18.41 26.03,17.12 v25.99,17.12 25.99,18.12 v25.3,18.81 | v28.89,6.86 29.31,7.28 30.28,7.28 30.98,7.98 30.98,18.53 31.07,18.62 | v39.24,80.2 39.24,82.06 v39.81,82.63 | v29.69,42.1 32.86,42.1 C5.1 33.63,42.86 U$3.15 33.63,46.14 34.59,47.1 v36.04,47.1 37.08,48.14 C7.1 37.86,48.52 C6.1 37.86,50.47 38.1,50.71 38.1,53.48 38.05,53.53 IC1.2 38.1,54.63 C8.1
  Top 1.27: U2.P$27 U2.P$13
  Bottom 0.152: v8.5,65.81 8.9,66.21 v14.5,66.21 | v5.3,61.21 v7,61.21 | v16.6,66.11 v18.8,66.11 | R1.1 44.75,17.83 | U$9.14 48.44,14.14 47.67,14.91 | 47.67,14.91 R1.1 | v17.4,47.81 v12.7,47.81 12.6,47.81 v9.9,50.51 | R1.1 47.69,15.04 v48.83,16.18 50.56,14.45 52.76,14.45 U$9.20 56.06,15.25 v59.67,18.86 | C2.1 35.72,23.71 37.43,23.71 IC4.1 38.24,23.89 38.8,23.89 | v21.4,46.81 21.4,43.71 22.78,42.33 23.6,42.33 | 23.6,42.33 U2.P$27 | v41.9,57.71 43.3,59.11 v43.9,59.11 42.8,60.21 v42.8,60.71 41.5,62.01 41.5,67.41 42.1,68.01 43.1,68.01 v43.5,67.61 | R36.1 18.5,34.06 17.98,33.54 C17.1 16.44,33.5 C18.1 17.49,32.13 v17.83,32.47 18.06,32.47 v19.2,33.61 19,33.41 | 15.95,25.81 R13.2 | R13.2 15.92,25.86 14.28,27.51 U7.10 11.04,27.51 10.87,27.34 10.87,27.04 | 16.55,20.66 v16.6,20.61 17.7,19.51 v17.7,18.61 | v10.45,34.48 10.75,34.48 11.23,34.01 U7.23 | R13.2 16.95,25.86 17.3,25.51 17.3,24.21 C16.1 17.2,22.84 16.57,22.21 C13.1 15.95,21.26 16.55,20.66 | R36.1 20.15,36.71 20.6,36.71 22.1,35.21 | 22.1,35.21 23.5,35.21 24,35.71 24,37.71 23.3,38.41 22.7,38.41 21.9,39.21 21.9,40.63 23.6,42.33 | 7.92,31.23 6.9,30.21 6.9,28.41 8.24,27.07 | 7.92,31.23 9.7,33.01 v10,33.01 | v9.4,29.41 9.4,31.51 9.99,32.1 | v10,33.01 10,32.11 9.99,32.1 | v12.4,21.61 13.4,20.61 v13.4,20.41 | v14.9,19.81 15.7,19.81 16.55,20.66 | SPI-LED.GND 10.2,7.31 v10,7.11 10.7,6.41 10.7,4.7 v13.54,1.86 | v78.72,6.16 v81.26,3.62 83.8,6.16 v87.61,6.16 | v74.91,2.35 v71.1,6.16 | v67.29,2.35 v64.75,4.89 | v60.94,2.35 59.67,2.35 v57.13,4.89 | v54.59,2.35 53.32,2.35 v50.78,4.89 | v48.24,2.35 46.97,2.35 v44.43,4.89 | v41.89,2.35 v38.08,2.35 | 7.92,31.23 7.6,31.56 v7.6,32.83
  Bottom 0.152: v12.68,40.45 11.63,40.45 11.53,40.56 11.3,40.56 v10.14,41.72 | v3.79,45.53 v3.79,49.34 | v6.33,53.15 v7.6,54.42 10.14,51.88 v17.76,51.88 | 22.1,35.21 22.84,34.47 v22.84,32.83 v24.11,34.1 25.49,34.1 v26.1,34.71 | v22.84,30.29 v22.84,27.75 | v22.84,25.21 v22.84,22.67 | v63.48,15.05 v67.29,18.86 | v71.1,15.05 v74.91,18.86 | v78.72,15.05 v82.53,18.86 | v8.87,25.21 v7.6,23.94 8.03,23.51 U7.2 | v3.79,15.05 5.06,13.78 v5.06,11.24 | v55.86,18.86 v53.32,16.32 | v50.78,18.86 v45.7,18.86 44.71,17.87 44.17,17.87 IC4.14 43.31,17 42.19,17 41.38,17.81 v40.59,17.81 | v26.3,66.31 23.8,68.81 v23.8,69.91 | v21.2,75.81 25,72.01 v25.9,72.01 | v43.4,83.51 43.4,74.61 v42.4,73.61 41.7,74.31 40.9,74.31 40.6,74.01 v40.6,71.61 | v15.4,70.71 15.4,80.61 v15.5,80.71 | v41.7,37.81 41.7,35.91 v42.5,35.11 | v42.4,32.21 42.4,29.01 v42.7,28.71 | 44.75,13.57 R3.1 46.13,13.37 47.67,14.91 | v36.04,47.1 36.04,41.21 v35.43,40.6 | v21.13,15.3 19.61,16.82 v19.56,16.82 | v30.68,1.05 30.66,1.08 20.04,1.08 v19.56,1.56 | v28.17,47.74 28.17,47.91 27.43,48.65 22.55,48.65 20.6,50.61 v19.03,50.61 19.62,51.2 v21.92,51.2 | v28.37,44.76 28.37,43.42 v29.69,42.1 | v31.14,47.63 32.49,47.63 32.94,48.09 32.94,49.54 31.14,51.34 31.14,53.43 30.63,53.93 v30.63,54.01 | 38.8,23.89 38.86,23.89 39.12,23.63 | 39.12,23.63 39.52,23.23 | 39.52,23.23 39.95,22.79 | 39.95,22.79 39.95,21.92 IC4.5 37.6,19.56 37.6,18.71 v37.2,18.31 36.35,18.31 IC4.24 | IC4.4 39.91,22.79 39.95,22.79 | IC4.3 39.42,23.23 39.52,23.23 | IC4.2 38.91,23.63 39.12,23.63 | U7.6 11.05,25.51 10.87,25.69 10.87,25.99 | 10.87,25.99 10.87,26.45 | 10.87,26.45 10.87,26.98 | 10.87,26.98 10.87,27.04
  Bottom 0.152: U7.9 10.89,27.01 10.87,26.98 | U7.8 10.93,26.51 10.87,26.45 | U7.7 12.36,25.99 10.87,25.99 | 10.87,27.04 8.27,27.04 8.24,27.07 | v7.6,26.48 8.19,27.07 8.24,27.07 | U7.14 10.8,29.51 v10.2,30.11 10.3,30.01 U7.15 | U7.18 10.59,31.51 9.99,32.1 | U7.19 11,32.01 v10,33.01 | U7.21 v10,33.01 | v25.3,80.61 26.6,80.61 v28,79.21 27.5,78.71 v25.2,78.71 25.2,77.01 v26.7,75.51 27.6,74.61 v29.5,74.61 | v40.3,69.61 v38.2,71.71 39.15,72.66 I2C.GND 39.15,80.11 v39.24,80.2 | C9.1 34.71,13.84 C3.1 35.47,13.97 v35.84,13.6 | U$11.#2 32.36,17.44 v32.36,17.53 | v38.06,24.83 38.8,24.09 38.8,23.89 | v15.46,6.89 17.19,5.16 20.45,5.16 v20.7,5.41 | v24.11,20.13 25.3,18.94 v25.3,18.81 | C12.1 17.39,35.77 17.39,35.76 18.09,35.06 R36.1
  pour Bottom (rank 6): -16.5,100.51 97.7,100.51 97.7,-1.49 -16.5,-1.49
  pour Top (rank 6): -16.7,101.01 98,101.01 98,-2.89 -16.7,-2.89
LED0
  Bottom 0.152: R2.1 40.47,21.51 IC4.6
LED1
  Bottom 0.152: R4.1 41.47,21.59 IC4.7
MOSI1
  Top 0.152: U2.P$25 22.7,47.41 20.72,49.39 20.72,51.63 19.32,53.03 R9.2
  Top 1.27: U2.P$25 U2.P$11
MOSI2  (via drill 0.35)
  Top 0.152: v6.8,50.31 8.2,51.71 16,51.71 16.9,52.61 16.9,55.06 LED1.SDO
  Bottom 0.152: v6.8,50.31 6.8,41.61 5.91,40.72 5.91,20.02 7.03,18.91 14.8,18.91 16.2,17.51 16.2,17.48 | 16.2,17.48 SPI-LED.DI | LED.DI 21.34,6.92 20.4,7.86 20.4,14.41 17.32,17.48 16.2,17.48
MS
  Top 0.152: R9.1 18.02,54.63 17.61,55.04 17.61,55.83 LED1.SDI
N$3
  Bottom 0.152: U7.29 13.32,37.01 13.5,37.18 13.5,39.89 14.27,40.66 C22.2
N$5  (via drill 0.35)
  Top 0.152: U2.P$1 37.55,35.91 23.4,35.91 v22.3,37.01 | v9.36,47.67 9.1,47.41 9.1,45.41 9.13,45.44 U3.7
  Top 1.27: U2.P$1 U2.P$15
  Bottom 0.152: v22.3,37.01 22.3,37.61 17.4,42.51 13.4,42.51 10.9,45.01 10.9,47.12 10.36,47.67 v9.36,47.67
N$6
  Top 0.152: U1.2 13.61,54.75 R26.1
N$7
  Bottom 0.152: R3.2 41.15,13.37 37.08,17.43 36.39,17.43 IC4.23
N$8  (via drill 0.35)
  Top 0.152: U2.P$2 39.6,40.5 39.6,39.61 36.8,36.81 23.5,36.81 21.4,38.91 21.4,41.41 v20.5,42.31 | v8.4,48.71 7.87,48.17 U3.6
  Top 1.27: U2.P$2 U2.P$16
  Bottom 0.152: v20.5,42.31 19.3,43.51 13.7,43.51 11.7,45.51 11.7,47.41 10.3,48.81 8.5,48.81 v8.4,48.71
N$9
  Top 0.152: R15.1 6.62,56.64 U3.4
N$12  (via drill 0.35)
  Top 0.152: R16.1 30.3,59.6 30.3,59.01 v29.6,58.31 | v10.4,58.41 U3.1
  Bottom 0.152: v29.6,58.31 29.5,58.41 28.2,58.41 26.6,60.01 12,60.01 v10.4,58.41
N$14
  Bottom 0.152: R13.1 13.55,25.01 U7.5
N$16
  Bottom 0.152: U7.27 13.69,36.01 13.83,35.86 15.65,35.86 16.48,35.03 C19.2
N$17
  Bottom 0.152: U7.3 13.69,24.01 14.35,23.35 C13.2
N$18
  Bottom 0.152: U7.17 13.35,31.01 14.76,29.59 R31.2
N$21
  Bottom 0.152: C19.1 14.17,34.94 13.6,35.51 U7.26
N$22
  Bottom 0.152: U7.28 13.66,36.51 14,36.84 14,39.23 14.38,39.61 16.1,39.61 16.4,39.91 C22.1
N$23
  Top 0.152: R8.1 2.8,60.21 R24.1 4,59.71 4,58.11 Q3.G
N$24
  Top 0.152: R7.2 RCPWR.CATHODE
N$25
  Bottom 0.152: C16.2 14.84,24.11 14.44,24.51 U7.4
N$26  (via drill 0.35)
  Top 0.152: R26.2 13.61,58.51 v13.4,58.51 | v4.5,55.11 3.7,55.91 3.7,57.06 Q3.D
  Bottom 0.152: v13.4,58.51 11.7,56.81 7.7,56.81 6,55.11 v4.5,55.11
N$27  (via drill 0.35)
  Top 0.152: R27.2 8,60.91 v8.4,61.31 | v31.4,57.41 Q4.D
  Bottom 0.152: v8.4,61.31 9.1,60.61 29,60.61 31.4,58.21 v31.4,57.41
N$28
  Top 0.152: R27.1 8,56.74 U3.3
N$29  (via drill 0.35)
  Top 0.152: R29.2 12.05,58.96 v12.5,59.41 | v34.2,58.21 33.8,58.61 33,58.61 Q5.D
  Bottom 0.152: v12.5,59.41 26,59.41 29.9,55.51 32.5,55.51 34.2,57.21 v34.2,58.21
N$30
  Top 0.152: R29.1 12.05,54.96 11.3,54.21 9.5,54.21 9.13,54.57 U3.2
N$32  (via drill 0.35)
  Top 0.152: v19.2,38.11 19.1,38.01 18.1,38.01 16.1,36.01 9.9,36.01 8.6,34.71 8.6,32.91 9.5,32.01 11.6,32.01 14.2,29.41 15,29.41 v15.93,28.49
  Bottom 0.152: v19.2,38.11 19.2,37.41 D1.ANODE 18.4,37.02 17.79,37.64 15.77,37.64 R25.2 14.8,36.76 C12.2 | R31.1 16.48,29.04 v15.93,28.49
N$33
  Top 0.152: Q5.G 35.35,61.01 R32.1 35.95,60.86 36.6,60.21 36.6,56.33 36.09,55.82 36.09,53.98 R34.2
N$34
  Top 0.61: D4.1 20.89,44.87 U2.P$26
  Top 1.27: U2.P$26 U2.P$12
N$37
  Bottom 0.152: R36.2 20.5,31.61 R37.1 18.95,29.96 16.71,27.72 15.4,27.72 13.95,29.17 13.95,29.75 13.19,30.51 U7.16
N$38
  Top 0.152: R35.2 33.65,56.96 Q4.G 31.55,55.36 R33.1
N$40
  Top 0.152: C6.2 36.26,50.09 IC1.4
N$41  (via drill 0.35)
  Top 0.152: v40.8,15.41 40.07,15.41 38.5,13.84 v37.07,13.84
  Bottom 0.152: v40.8,15.41 41.17,15.04 R1.2 | IC4.25 34.33,17.21 U$11.#3 34.5,16.67 C3.2 35.53,15.7 36.39,14.84 36.39,14.52 v37.07,13.84
N$50
  Bottom 0.152: 14.68,30.84 R19.2 14.43,30.84 13.72,31.56 13.72,32.19 13.4,32.51 U7.20
NC5
  Top 1.27: U2.P$24 U2.P$10
PCH1
  Top 0.152: 17.5,63.49 U$1.7:SIGNAL1
  Top 0.254: R12.1 17.5,62.61 17.7,62.81 17.7,63.33 U$1.7:SIGNAL1
PCH2
  Top 0.152: R11.1 U$1.4:SIGNAL2
PCH3_328  (via drill 0.35)
  Top 0.152: U2.P$3 39,42.44 39,40.26 36.22,37.48 23.83,37.48 22,39.31 22,42.21 19.8,44.41 v18.7,44.41 | v14.2,44.61 R6.1 14.2,47.55 U1.3
  Top 1.27: U2.P$3 U2.P$17
  Bottom 0.152: v18.7,44.41 14.4,44.41 v14.2,44.61
PCH_3
  Top 0.152: U$1.1:SIGNAL3 2.28,61.29 R8.2
RC_CH1_ST
  Top 0.152: 27.73,63.46 U$1.11:ST_SIGNAL
  Top 0.254: R20.2 27.7,61.25 27.7,63.49 U$1.11:ST_SIGNAL
RC_CH2_TH
  Top 0.152: 37.88,62.53 37.8,62.61 37.8,63.47 U$1.15:TH_SINGNAL
  Top 0.254: R21.2 37.84,61.31 U$1.15:TH_SINGNAL
RCH1  (via drill 0.35)
  Top 0.152: R20.1 27.73,54.96 v29.2,53.49 | U$3.4 32.33,48.94 v32,48.61
  Bottom 0.152: v29.2,53.49 30.39,52.3 30.39,49.08 30.86,48.61 v32,48.61
RCH2  (via drill 0.35)
  Top 0.152: R21.1 37.88,58.78 v37.6,58.51 | v32.75,54.33 32.32,54.33 30.38,52.39 U$3.7
  Bottom 0.152: v37.6,58.51 33.42,54.33 v32.75,54.33
RECV_CH1  (via drill 0.35)
  Top 0.152: v19.42,58.51 v19.41,58.51 18.26,59.66 R12.2 | v32.44,46.69 33.63,47.89 U$3.2 33.63,51.06 34.24,51.68 R34.1
  Bottom 0.152: v19.42,58.51 25.2,58.51 28.3,55.41 28.3,49.21 30.82,46.69 v32.44,46.69
RECV_CH2  (via drill 0.35)
  Top 0.152: R35.1 35.2,54.66 31.68,51.14 U$3.5 31.68,49.39 31.17,48.88 29.21,48.88 28.9,49.19 28.9,52.51 27.6,53.81 v21.6,53.81 | R11.2 11,59.71 11.6,60.31 13.6,60.31 15,58.91 v15,58.71
  Bottom 0.152: v15,58.71 19.9,53.81 v21.6,53.81
SCL  (via drill 0.35)
  Top 0.152: v42.9,20.71 42,19.81 v36.3,19.81 | v29.95,4.4 31.74,2.61 v35.3,2.61
  Top 1.27: U2.P$6 U2.P$20
  Bottom 0.152: v42.9,20.71 43.9,21.71 43.9,36.11 42.7,37.31 42.7,51.22 U2.P$6 40.42,52.49 39.3,53.61 39.3,57.01 40.1,57.81 40.1,65.11 32.5,72.71 26.5,72.71 21.3,77.91 21.3,80.01 23.2,81.91 31.9,81.91 32.85,80.96 32.85,75.16 I2C.SCL | v36.3,19.81 36.01,19.81 IC4.26 34.11,17.92 33.35,17.92 32.7,18.56 32.09,18.56 31.61,18.08 31.61,16.02 31.24,15.65 31.24,14.08 32.33,12.99 34.27,12.99 34.66,12.6 36.34,12.6 37,11.94 37,9.9 37.3,9.6 37.3,9.58 U$9.5 38.34,8.67 | 38.34,8.67 38.44,8.77 | v29.95,4.4 29.65,4.4 25.59,8.47 25.59,12.5 18.7,19.38 18.7,25.11 16.67,27.14 15.29,27.14 13.42,29.01 U7.13 | v35.3,2.61 37.54,4.85 R22.1 38.34,5.86 38.34,8.67
SDA  (via drill 0.35)
  Top 0.152: v42.6,22.21 41.4,21.01 v37.83,21.01 37.06,21.78 34.52,21.78 32.23,19.49 v28.47,19.49 | v8.2,29.01 8.2,30.11 8.9,30.81 11.4,30.81 19.2,23.01 19.2,20.96 v23.39,16.77 | v33.7,3.91 33.7,6.57 U$9.3
  Top 1.27: U2.P$5 U2.P$19
  Bottom 0.152: U$9.3 34.4,9.95 34.4,12.02 33.94,12.48 30.29,12.48 30.27,12.46 30.2,12.46 29.81,12.85 26.16,12.85 23.48,15.53 23.48,16.68 v23.39,16.77 24.46,16.77 27.2,19.51 28.45,19.51 v28.47,19.49 | R23.1 34.11,3.91 v33.7,3.91 | v42.6,22.21 42.8,22.41 42.8,27.11 41.2,28.71 41.2,36.91 39.6,38.51 39.6,48.12 U2.P$5 41.36,49.95 38.4,52.91 38.4,57.91 38.8,58.31 38.8,63.01 31,70.81 24.8,70.81 19.9,75.71 19.9,80.21 22.5,82.81 33,82.81 35.15,80.66 I2C.SDA | IC4.27 36.29,21.01 v37.83,21.01 | U7.12 8.7,28.51 | 8.7,28.51 v8.2,29.01 | U7.11 9.2,28.01 8.7,28.51
SIGNAL_SELCET  (via drill 0.35)
  Top 0.152: U2.P$4 38.4,44.38 38.4,40.92 35.79,38.31 v34.1,38.31 R5.2 | v34.57,48.35 34.57,48.93 34.28,49.22 U$3.1
  Top 1.27: U2.P$4 U2.P$18
  Bottom 0.152: v34.1,38.31 31.9,40.51 31.9,45.09 34.57,47.76 v34.57,48.35
XIAO_5V
  Top 1.27: U2.P$28 U2.P$14
XIAO_RX
  Top 1.27: U2.P$22 U2.P$8
XIAO_TX
  Top 1.27: U2.P$7 U2.P$21

### Text on the board
tPlace: ch | ch | ch | 3 | 2 | 1 | ST | TH | VCC | VCC | VCC | VCC | VCC | SIGNAL | SIGNAL | SIGNAL | SIGNAL | SIGNAL | D0 | 1 | Rev 3.0.2
bPlace: Rev 3.0.2 | F-612-3-0-2-A-N-J-1-PCB
Document: Jetson Nano DevKit / B-01 (A02) | #612 JetRacer Rev 3.0.2 / 2023/12/18,19
_tNames: LP2985-33DBVR | TLP2270 | XIAO | TLP291 | MC74VHC157 | PCA9685 | 0.96inchOLED